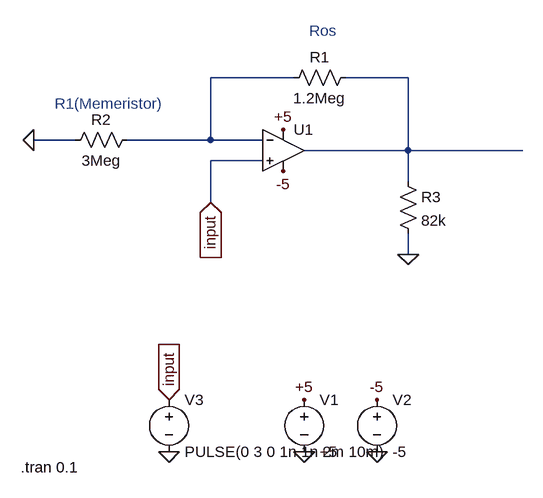
[diagram p0: schematic exp_setup.asc]
exp_setup.asc, the LTspice schematic file:
Version 4
SHEET 1 880 680
WIRE 256 48 128 48
WIRE 432 48 336 48
WIRE -80 144 -144 144
WIRE 128 144 128 48
WIRE 128 144 0 144
WIRE 208 144 128 144
WIRE 432 160 432 48
WIRE 432 160 272 160
WIRE 608 160 432 160
WIRE 208 176 128 176
WIRE 432 208 432 160
WIRE 128 240 128 176
WIRE 432 320 432 288
FLAG 240 128 +5
FLAG 240 192 -5
FLAG 432 320 0
FLAG 128 240 input
IOPIN 128 240 In
FLAG -144 144 0
FLAG 64 624 0
FLAG 272 624 0
FLAG 384 624 0
FLAG 384 544 -5
FLAG 272 544 +5
FLAG 64 544 input
IOPIN 64 544 In
SYMBOL Opamps\\UniversalOpamp2 240 160 R0
SYMATTR InstName U1
SYMBOL res 352 32 R90
WINDOW 0 0 56 VBottom 2
WINDOW 3 32 56 VTop 2
SYMATTR InstName R1
SYMATTR Value 1.2Meg
SYMBOL res 16 128 R90
WINDOW 0 0 56 VBottom 2
WINDOW 3 32 56 VTop 2
SYMATTR InstName R2
SYMATTR Value 3Meg
SYMBOL res 416 192 R0
SYMATTR InstName R3
SYMATTR Value 82k
SYMBOL voltage 272 528 R0
WINDOW 123 0 0 Left 0
WINDOW 39 0 0 Left 0
SYMATTR InstName V1
SYMATTR Value +5
SYMBOL voltage 384 528 R0
WINDOW 123 0 0 Left 0
WINDOW 39 0 0 Left 0
SYMATTR InstName V2
SYMATTR Value -5
SYMBOL voltage 64 528 R0
WINDOW 123 0 0 Left 0
WINDOW 39 0 0 Left 0
SYMATTR InstName V3
SYMATTR Value PULSE(0 3 0 1n 1n 2m 10m)
TEXT -164 648 Left 2 !.tran 0.1
TEXT 280 -24 Left 2 ;Ros
TEXT -112 88 Left 2 ;R1(Memeristor)

The netlist it stands for:
* exp_setup.asc
XU1 input N001 +5 -5 N002 level.2 Avol=1Meg GBW=10Meg Slew=10Meg ilimit=25m rail=0 Vos=0 phimargin=45 en=0 enk=0 in=0 ink=0 Rin=500Meg  ; pins IN+ IN- V+ V- OUT
R1 N002 N001 1.2Meg
R2 N001 0 3Meg
R3 N002 0 82k
V1 +5 0 +5
V2 -5 0 -5
V3 input 0 PULSE(0 3 0 1n 1n 2m 10m)
.tran 0.1
* Ros
* R1(Memeristor)
.lib UniversalOpamps2.sub
.backanno
.end